# EAGLE design radio_V12.09.03 (EAGLE 5.01)
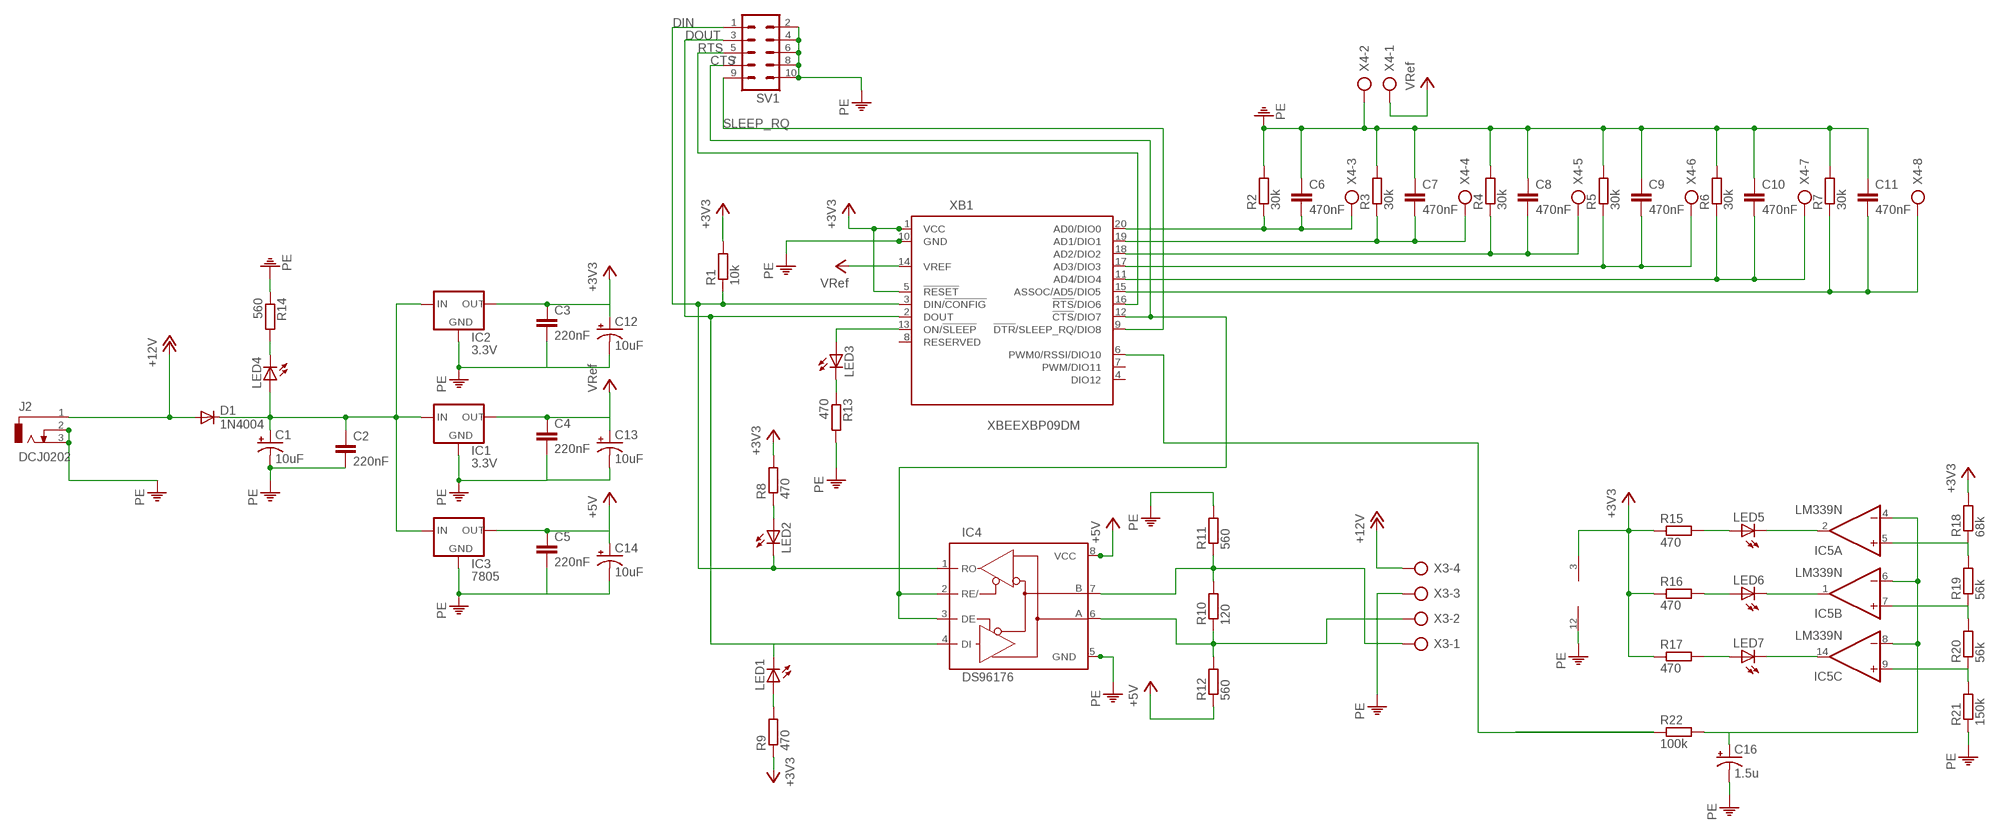
[diagram p0: schematic, sheet 1]

## Parts
C1  10uF  CPOL-USE2-5  [E2-5]
C2  220nF  C5/3.5  [C5B3.5]
C3  220nF  C5/3.5  [C5B3.5]
C4  220nF  C5/3.5  [C5B3.5]
C5  220nF  C5/3.5  [C5B3.5]
C6  470nF  C5/3.5  [C5B3.5]
C7  470nF  C5/3.5  [C5B3.5]
C8  470nF  C5/3.5  [C5B3.5]
C9  470nF  C5/3.5  [C5B3.5]
C10  470nF  C5/3.5  [C5B3.5]
C11  470nF  C5/3.5  [C5B3.5]
C12  10uF  CPOL-USE2-5  [E2-5]
C13  10uF  CPOL-USE2-5  [E2-5]
C14  10uF  CPOL-USE2-5  [E2-5]
C16  1.5u  CPOL-USE2-5  [E2-5]
D1  1N4004  [DO41-10]
IC1  3.3V  78XXL  [78XXL]
IC2  3.3V  78XXL  [78XXL]
IC3  7805  78XXL  [78XXL]
IC4  DS96176  MAX3468CPA  [DIL08]
IC5  LM339N  [DIL14]
J2  DCJ0202  [DCJ0202]
LED1  LED3MM  [LED3MM]
LED2  LED3MM  [LED3MM]
LED3  LED3MM  [LED3MM]
LED4  LED5MM  [LED5MM]
LED5  LED3MM  [LED3MM]
LED6  LED3MM  [LED3MM]
LED7  LED3MM  [LED3MM]
R1  10k  R-EU_0207/7  [0207/7]
R2  30k  R-EU_0207/7  [0207/7]
R3  30k  R-EU_0207/7  [0207/7]
R4  30k  R-EU_0207/7  [0207/7]
R5  30k  R-EU_0207/7  [0207/7]
R6  30k  R-EU_0207/7  [0207/7]
R7  30k  R-EU_0207/7  [0207/7]
R8  470  R-EU_0207/7  [0207/7]
R9  470  R-EU_0207/7  [0207/7]
R10  120  R-EU_0207/7  [0207/7]
R11  560  R-EU_0207/7  [0207/7]
R12  560  R-EU_0207/7  [0207/7]
R13  470  R-EU_0207/7  [0207/7]
R14  560  R-EU_0207/7  [0207/7]
R15  470  R-EU_0207/7  [0207/7]
R16  470  R-EU_0207/7  [0207/7]
R17  470  R-EU_0207/7  [0207/7]
R18  68k  R-EU_0207/7  [0207/7]
R19  56k  R-EU_0207/7  [0207/7]
R20  56k  R-EU_0207/7  [0207/7]
R21  150k  R-EU_0207/7  [0207/7]
R22  100k  R-EU_0207/7  [0207/7]
SV1  ML10  [ML10]
X3  AK500/4-H  [AK500/4-H]
X4  AK500/8-H  [AK500/8-H]
XB1  XBEEXBP09DM  [XBEE-PRO]

## Nets
+3V3: C3.1 C12.+ IC2.OUT IC5.3(P:V+) R1.2 R8.2 R9.1 R15.1 R16.1 R17.1 R18.2 XB1.1(VCC) XB1.5(!RESET)
+5V: C5.1 C14.+ IC3.OUT IC4.8(VCC) R12.1
+12V: D1.A J2.1 X3.4
CTS: IC4.2(RE/) IC4.3(DE) SV1.7 XB1.12(!CTS!/DIO7)
DIN: IC4.1(RO) LED2.K(C) R1.1 SV1.1 XB1.3(DIN/!CONFIG)
DOUT: IC4.4(DI) LED1.K(C) SV1.3 XB1.2(DOUT)
N$2: C1.+ C2.1 D1.C IC1.IN IC2.IN IC3.IN LED4.A
N$3: C6.2 R2.1 X4.3 XB1.20(AD0/DIO0)
N$4: C7.2 R3.1 X4.4 XB1.19(AD1/DIO1)
N$5: C8.2 R4.1 X4.5 XB1.18(AD2/DIO2)
N$6: C9.2 R5.1 X4.6 XB1.17(AD3/DIO3)
N$7: C10.2 R6.1 X4.7 XB1.11(AD4/DIO4)
N$8: C11.2 R7.1 X4.8 XB1.15(ASSOC/AD5/DIO5)
N$10: LED2.A R8.1
N$11: LED1.A R9.2
N$13: LED3.A XB1.13(ON/!SLEEP)
N$14: LED3.K(C) R13.1
N$15: LED4.K(C) R14.2
N$16: IC4.6(A) R10.1 R12.2 X3.2
N$17: IC4.7(B) R10.2 R11.1 X3.1
N$24: IC5.2(A:OUT) LED5.K(C)
N$25: IC5.1(B:OUT) LED6.K(C)
N$26: IC5.14(C:OUT) LED7.K(C)
N$27: LED7.A R17.2
N$28: LED6.A R16.2
N$29: LED5.A R15.2
N$30: IC5.5(A:+IN) R18.1 R19.2
N$31: IC5.7(B:+IN) R19.1 R20.2
N$32: IC5.9(C:+IN) R20.1 R21.2
N$33: C16.+ IC5.4(A:-IN) IC5.6(B:-IN) IC5.8(C:-IN) R22.2
N$36: R22.1 XB1.6(PWM0/RSSI/DIO10)
PE: C1.- C2.2 C3.2 C4.2 C5.2 C6.1 C7.1 C8.1 C9.1 C10.1 C11.1 C12.- C13.- C14.- C16.- IC1.GND IC2.GND IC3.GND IC4.5(GND) IC5.12(P:GND) J2.2 J2.3 R2.2 R3.2 R4.2 R5.2 R6.2 R7.2 R11.2 R13.2 R14.1 R21.1 SV1.2 SV1.4 SV1.6 SV1.8 SV1.10 X3.3 X4.2 XB1.10(GND)
RTS: SV1.5 XB1.16(!RTS!/DIO6)
SLEEP_RQ: SV1.9 XB1.9(!DTR!/SLEEP_RQ/DIO8)
VCC: C4.1 C13.+ IC1.OUT X4.1 XB1.14(VREF) ; supply symbol labelled VRef
Unconnected: IC5.10(D:-IN) IC5.11(D:+IN) IC5.13(D:OUT) XB1.7(PWM/DIO11)

## Power pins joined to a net without a drawn wire
DIO12: XB1.4(DIO12)
RESERVED: XB1.8(RESERVED)

## Library data of the parts
C1 C12-C14 C16 = rcl:CPOL-US: POLARIZED CAPACITOR, American symbol
C2-C11 = capacitor-wima:C: CAPACITOR naming: grid - package width
D1 = diode:1N4004: DIODE general purpose rectifier, 1 A
IC1-IC3 = v-reg:78XXL: VOLTAGE REGULATOR
IC4 = maxim:MAX34*: +5V, Fail-Safe, 40Mbps, Profibus RS-485/RS-422 Transceivers Source: MAX3465-MAX3469.pdf
IC5 = linear:LM339: Low Power Low Offset Voltage Quad Comparators with open collector; LM139/LM239/LM339/LM2901/LM3302
J2 = con-jack:DCJ0202: DC POWER JACK Source: DCJ0202.pdf
LED1-LED7 = led:LED: LED OSRAM: - CHIPLED LG R971, LG N971, LY N971, LG Q971, LY Q971, LO R971, LY R971 LH N974, LH R974 LS Q976, LO Q976, LY Q976 LO Q996 - Hyper CHIPLED LW Q18S LB Q993, LB Q99A, LB R99A - SideLED LS A670, LO A670, LY A670, LG A670, LP A670 LB A673, LV A673, LT A673, LW A673 LH A674 LY A675 LS A676, LA A676, LO A676, LY A676, LW A676 LS A679, LY A679, LG A679 - Hyper Micro SIDELED® LS Y876, LA Y876, LO Y876, LY Y876 LT Y87S - SmartLED LW L88C, LW L88S LB L89C, LB L89S, LG L890 LS L89K, LO L89K, LY L89K LS L896, LA L896, LO L896, LY L896 - TOPLED LS T670, LO T670, LY T670, LG T670, LP T670 LSG T670, LSP T670, LSY T670, LOP T670, LYG T670 LG T671, LOG T671, LSG T671 LB T673, LV T673, LT T673, LW T673 LH T674 LS T676, LA T676, LO T676, LY T676, LB T676, LH T676, LSB T676, LW T676 LB T67C, LV T67C, LT T67C, LS T67K, LO T67K, LY T67K, LW E67C LS E67B, LA E67B, LO E67B, LY E67B, LB E67C, LV E67C, LT E67C LW T67C LS T679, LY T679, LG T679 LS T770, LO T770, LY T770, LG T770, LP T770 LB T773, LV T773, LT T773, LW T773 LH T774 LS E675, LA E675, LY E675, LS T675 LS T776, LA T776, LO T776, LY T776, LB T776 LHGB T686 LT T68C, LB T68C - Hyper Mini TOPLED® LB M676 - Mini TOPLED Santana® LG M470 LS M47K, LO M47K, LY M47K Source: http://www.osram.convergy.de - LUMILED® LXK2-PW12-R00, LXK2-PW12-S00, LXK2-PW14-U00, LXK2-PW14-V00 LXK2-PM12-R00, LXK2-PM12-S00, LXK2-PM14-U00 LXK2-PE12-Q00, LXK2-PE12-R00, LXK2-PE12-S00, LXK2-PE14-T00, LXK2-PE14-U00 LXK2-PB12-K00, LXK2-PB12-L00, LXK2-PB12-M00, LXK2-PB14-N00, LXK2-PB14-P00, LXK2-PB14-Q00 LXK2-PR12-L00, LXK2-PR12-M00, LXK2-PR14-Q00, LXK2-PR14-R00 LXK2-PD12-Q00, LXK2-PD12-R00, LXK2-PD12-S00 LXK2-PH12-R00, LXK2-PH12-S00 LXK2-PL12-P00, LXK2-PL12-Q00, LXK2-PL12-R00 Source: www.luxeon.com
R1-R22 = resistor:R-EU_: RESISTOR, European symbol
SV1 = con-harting-ml:ML10: HARTING
X3 = con-ptr500:AK500/4-H: CONNECTOR Aug. 2004 / PTR Meßtechnik: Die Bezeichnung der Serie AK505 wurde geändert. Es handelt sich hierbei um AK500 in horizontaler Ausführung.
X4 = con-ptr500:AK500/8-H: CONNECTOR Aug. 2004 / PTR Meßtechnik: Die Bezeichnung der Serie AK505 wurde geändert. Es handelt sich hierbei um AK500 in horizontaler Ausführung.
XB1 = maxstream3:XBEE: XBee (TM) /XBee-PRO(TM) OEM RF Modules Source: MaxStream, Inc. xbee_productmanual.pdf

## Board
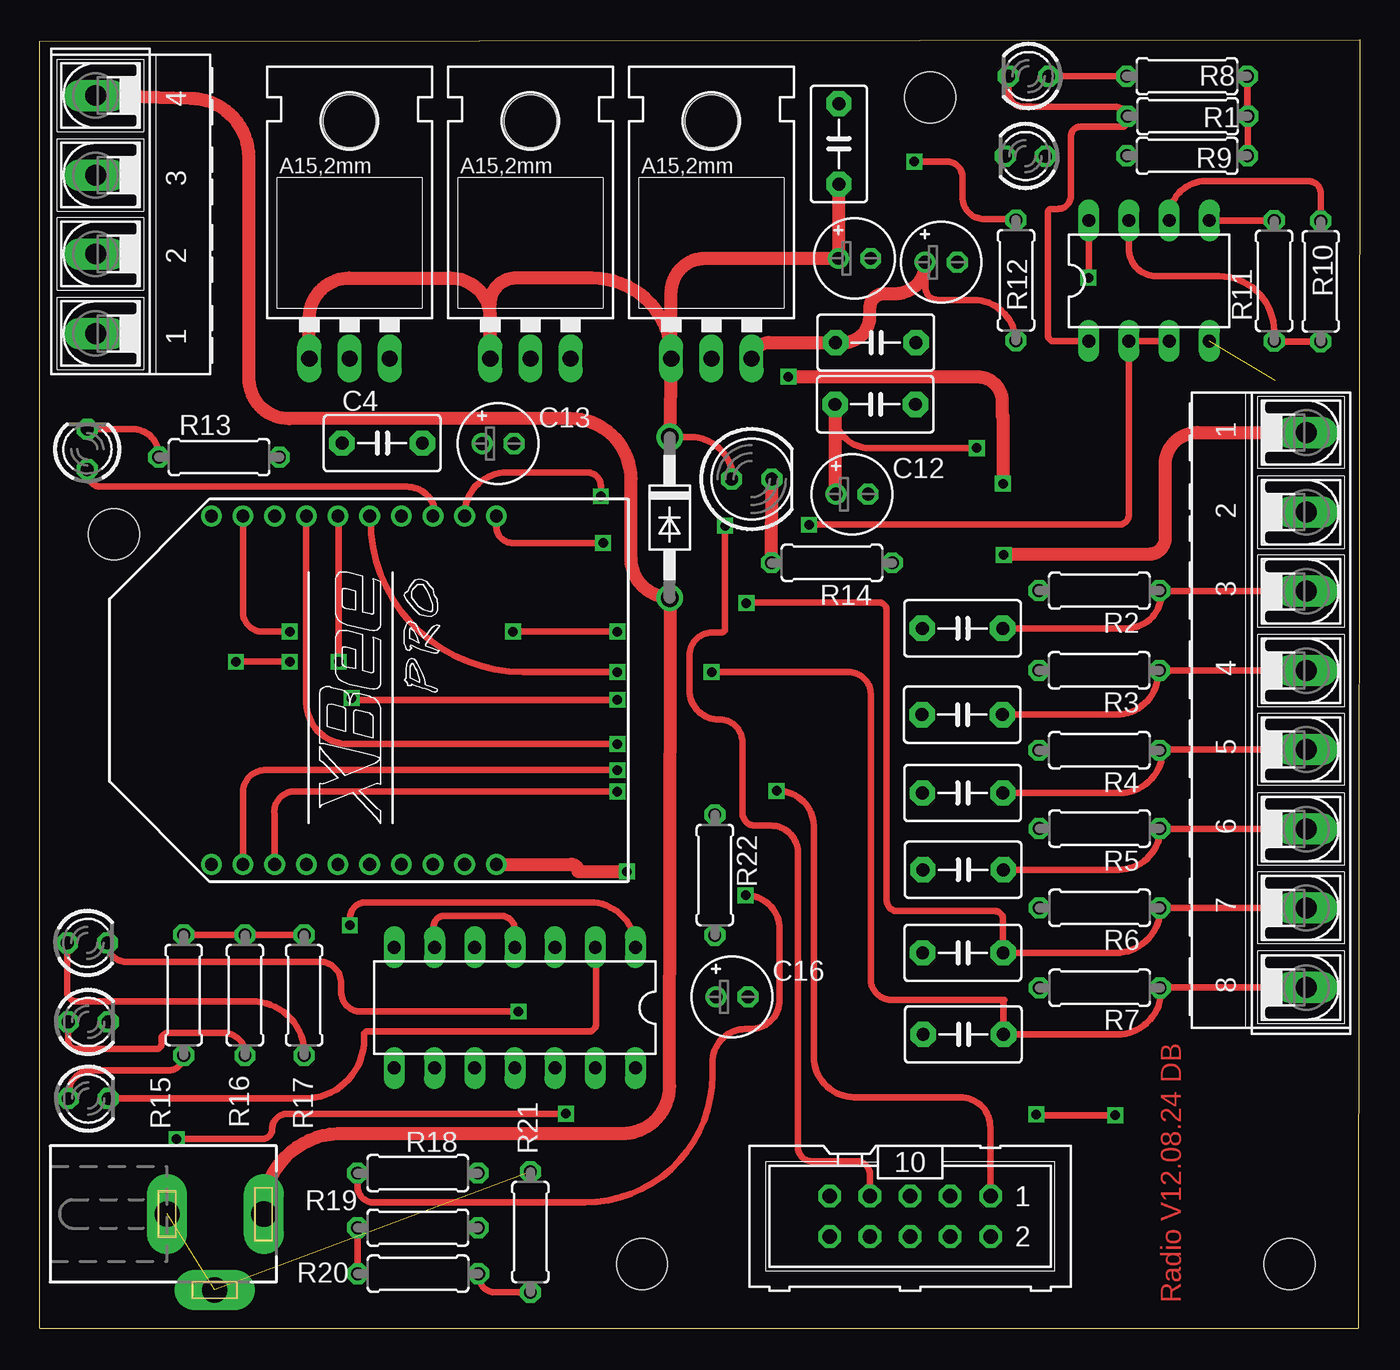
[diagram p1: board, top side]
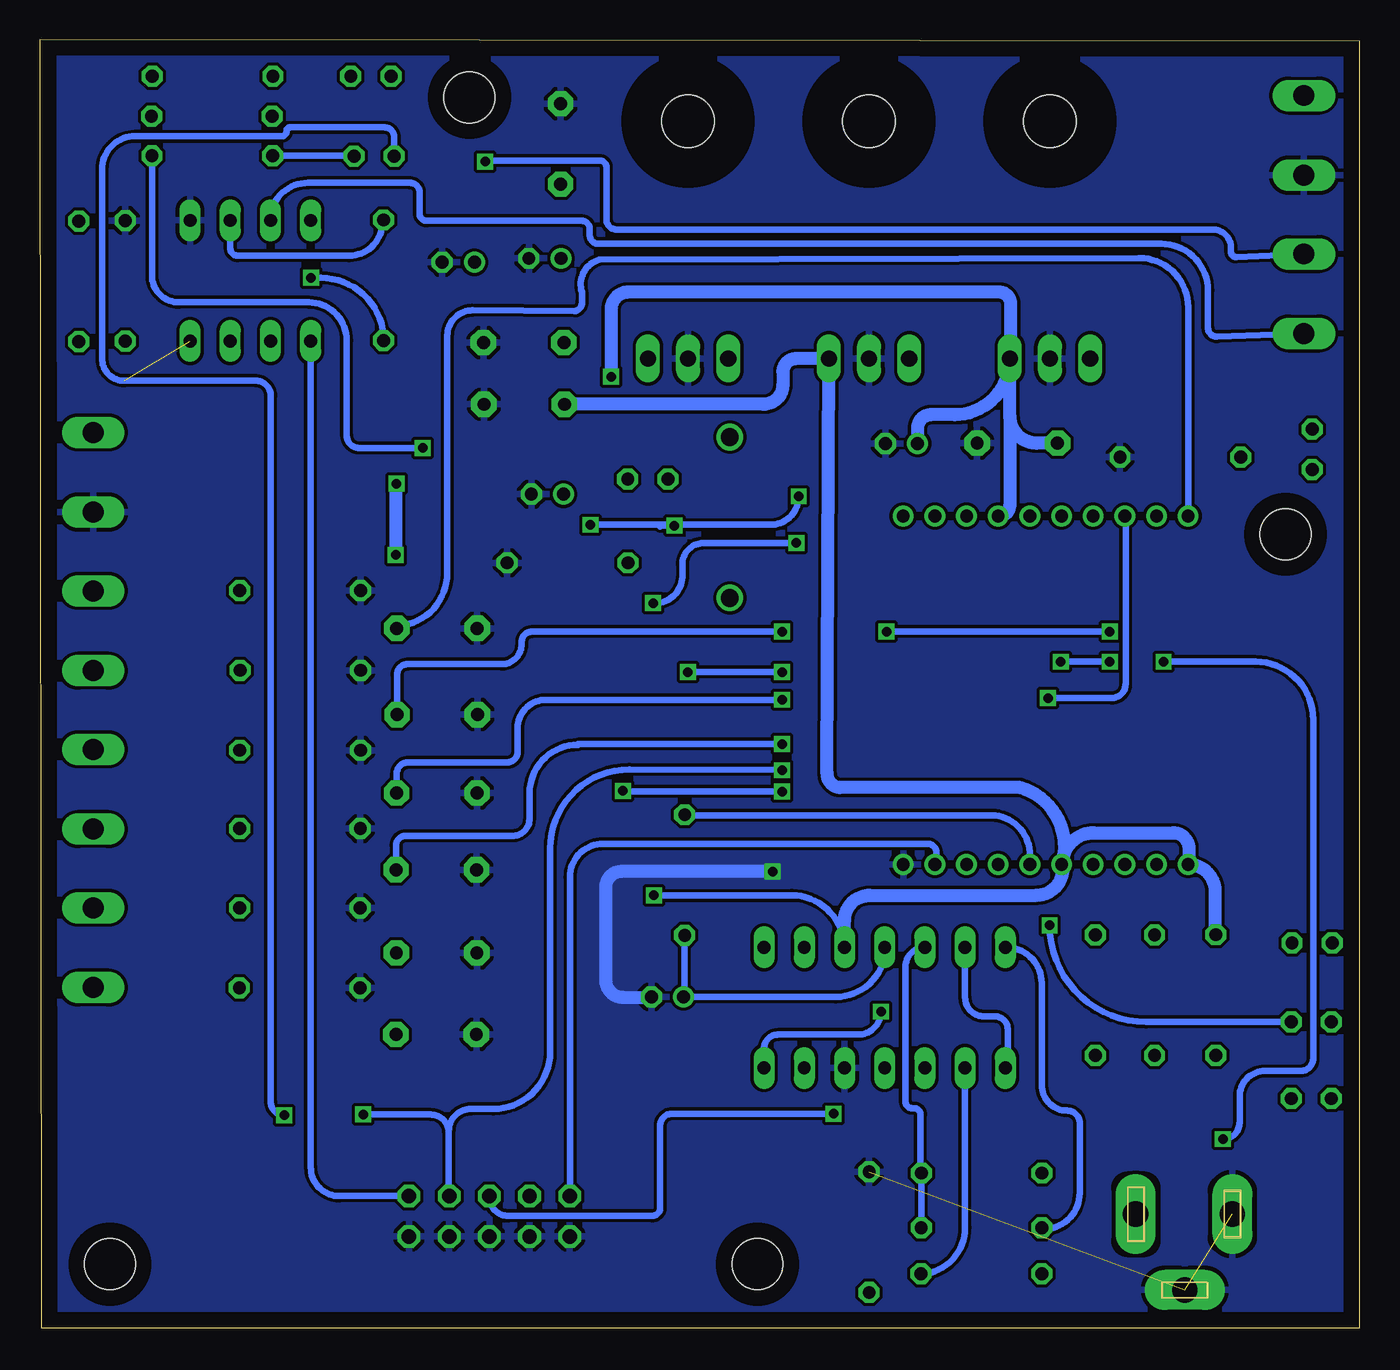
[diagram p2: board, bottom side, seen from below]

Size 83.4 x 81.4 mm. Coordinates in mm from the lower left corner, seen from the top.
Outline: 0,0 0,81.3 83.4,81.4 83.3,0 0,0
Outline: 7.5,8.7 8.6,8.7 8.6,5.7 7.5,5.7 7.5,8.7
Outline: 13.6,8.9 14.7,8.9 14.7,5.5 13.6,5.5 13.6,8.9
Outline: 9.6,1.9 12.5,1.9 12.5,2.9 9.6,2.9 9.6,1.9
Copper layers (1*16): Top 0.035mm / dielectric 1.5mm / Bottom 0.035mm
Design rules "default": minimum track width 10mil, minimum drill 24mil, track to track 8mil, track to pad 8mil, pad to pad 8mil, via to via 8mil, smd to smd 8mil, copper to edge 40mil, drill to drill 8mil, minimum pad ring 10mil, minimum via ring 8mil, stop-mask expansion 4mil, vias tented up to drill 0mil, thermal gap 10mil
Holes 3.2 mm at 78.95,4.05 38.05,4.05 56.25,77.75 4.7,50.15

### Footprints (pad centres in the part's own frame; a part is rotated, then mirrored left to right if it is on the bottom)
E2-5 = drill 0.813 pad 1.27 round: + -1.016,0 | drill 0.813 pad 1.27 octagon: - 1.016,0
C5B3.5 = drill 0.813 pad 1.6 octagon: 1 -2.54,0; 2 2.54,0
DO41-10 = drill 1.118 round: A 5.08,0; C -5.08,0
78XXL = drill 1.016 long: GND 0,-3.81; IN -2.54,-3.81; OUT 2.54,-3.81 | hole 3.302: 0,11.176
DIL08 = drill 0.813 long: 1 -3.81,-3.81; 2 -1.27,-3.81; 3 1.27,-3.81; 4 3.81,-3.81; 5 3.81,3.81; 6 1.27,3.81; 7 -1.27,3.81; 8 -3.81,3.81
DIL14 = drill 0.813 long: 1 -7.62,-3.81; 2 -5.08,-3.81; 3 -2.54,-3.81; 4 0,-3.81; 5 2.54,-3.81; 6 5.08,-3.81; 7 7.62,-3.81; 8 7.62,3.81; 9 5.08,3.81; 10 2.54,3.81; 11 0,3.81; 12 -2.54,3.81; 13 -5.08,3.81; 14 -7.62,3.81
DCJ0202 = drill 1.6 pad 2.54 long: 1 0,3.1; 2 4.8,0; 3 0,-3
LED3MM = drill 0.813 octagon: A -1.27,0; K 1.27,0
LED5MM = drill 0.813 octagon: A -1.27,0; K 1.27,0
0207/7 = drill 0.813 octagon: 1 -3.81,0; 2 3.81,0
ML10 = drill 0.914 octagon: 1 -5.08,-1.27; 2 -5.08,1.27; 3 -2.54,-1.27; 4 -2.54,1.27; 5 0,-1.27; 6 0,1.27; 7 2.54,-1.27; 8 2.54,1.27; 9 5.08,-1.27; 10 5.08,1.27
AK500/4-H = drill 1.321 long: 1 -7.518,0; 2 -2.489,0; 3 2.489,0; 4 7.518,0
AK500/8-H = drill 1.321 long: 1 -17.526,0; 2 -12.497,0; 3 -7.518,0; 4 -2.489,0; 5 2.489,0; 6 7.518,0; 7 12.497,0; 8 17.526,0
XBEE-PRO = drill 0.8 pad 1.27 round: 1 -11,9; 2 -11,7; 3 -11,5; 4 -11,3; 5 -11,1; 6 -11,-1; 7 -11,-3; 8 -11,-5; 9 -11,-7; 10 -11,-9; 11 11,-9; 12 11,-7; 13 11,-5; 14 11,-3; 15 11,-1; 16 11,1; 17 11,3; 18 11,5; 19 11,7; 20 11,9

### Placement (x,y rotation side)
C1  51.48,67.58 0 top
C2  50.49,74.81 90 top
C3  52.79,58.36 0 top
C4  21.64,55.91 0 top
C5  52.82,62.26 0 top
C6  58.3,44.21 0 top
C7  58.28,38.76 0 top
C8  58.31,33.81 0 top
C9  58.34,28.96 0 top
C10  58.32,23.71 0 top
C11  58.35,18.56 0 top
C12  51.32,52.68 0 top
C13  28.96,55.88 0 top
C14  56.95,67.33 0 top
C16  43.74,20.93 0 top
D1  39.8,51.21 270 top
IC1  19.58,65.07 0 top
IC2  31.01,65.07 0 top
IC3  42.44,65.07 0 top
IC4  70.08,66.17 0 top
IC5  30.02,20.25 180 top
J2  11.06,7.22 270 top
LED1  62.27,74.04 180 top
LED2  62.47,79.09 180 top
LED3  3.02,55.52 90 top
LED4  44.98,53.64 0 top
LED5  3.07,14.51 0 top
LED6  3.07,19.35 0 top
LED7  3.02,24.34 0 top
R1  72.52,76.56 0 top
R2  66.94,46.59 180 top
R3  66.93,41.56 180 top
R4  66.94,36.51 180 top
R5  66.95,31.56 180 top
R6  66.96,26.56 180 top
R7  66.97,21.51 180 top
R8  72.47,79.09 0 top
R9  72.49,74.06 180 top
R10  80.92,66.13 270 top
R11  77.98,66.16 90 top
R12  61.68,66.2 90 top
R13  11.34,55.02 0 top
R14  50.05,48.35 180 top
R15  9.1,21.05 270 top
R16  12.97,21.04 270 top
R17  16.71,21.04 270 top
R18  23.89,9.8 180 top
R19  23.9,6.35 0 top
R20  23.91,3.45 180 top
R21  31,6.07 270 top
R22  42.65,28.63 270 top
SV1  54.99,7.07 180 top
X3  3.54,70.35 90 top
X4  80.01,39.05 270 top
XB1  19.85,40.3 90 top

### Tracks (layer width: path | path; a pad name or v marks a point on that pad's centre or on a via)
+3V3  (via drill 0.6)
  Top 0.406: R16.1 13,24.85 | R15.1 arc90 R15.1 R16.1 | R16.1 R17.1 | R18.2 20.08,8.97 arc90 21.1,7.95 34.45,7.95 arc90 42.5,16 42.5,16.8 arc-90 44.6,18.9 44.9,18.9 arc90 46.75,20.75 46.75,25.2 arc90 v44.6,27.35 | R8.2 76.28,76.77 arc90 76.4,76.65 arc90 76.33,76.58 R1.2 76.33,74.17 arc90 76.45,74.05 arc90 76.44,74.06 R9.1 | 50.25,58.2 50.25,57.75 arc90 52.4,55.6 v59.2,55.6
  Top 0.813: C12.+ 50.3,52.8 arc90 50.25,52.85 50.25,58.2 C3.1
  Bottom 0.406: IC5.3 32.59,24.06 arc-90 32.6,24.05 arc-90 35.9,27.35 v44.6,27.35 | R9.1 76.3,66.5 arc-90 74.6,64.8 66.4,64.8 arc90 64,62.4 64,56.4 | 64,56.4 64,56.3 | C3.1 50.25,58.2 | v59.2,55.6 63.2,55.6 arc90 64,56.4
  Bottom 0.813: 18.8,29.3 arc-90 21.45,34.15 32.85,34.15 arc90 33.65,35.1 IC2.OUT 33.59,61.26 arc-90 33.6,61.25 35.6,61.25 arc-90 36.45,60.4 36.45,59.6 arc90 37.69,58.36 C3.1 | 18.8,29.3 XB1.5 18.85,29.15 arc-90 18.75,29.05 arc90 20.45,27.35 30.95,27.35 arc-90 32.56,25.74 IC5.3 | 18.8,29.3 arc90 16.8,31.3 11.8,31.3 arc90 10.8,30.3 10.8,29.35 arc90 XB1.1 arc90 9.15,27.6 9.15,24.91 arc-90 R15.1
+5V  (via drill 0.6)
  Top 0.406: 55.95,67.25 55.95,65.75 arc90 56.75,64.95 59,64.95 arc-90 61.65,62.3 arc90 61.68,62.33 R12.1 | IC4.8 66.27,66.37 arc-90 v66.25,66.35
  Top 0.813: IC3.OUT 45.04,61.26 arc-90 45.05,61.25 arc-90 46.06,62.26 C5.1 50.76,62.26 arc90 52.45,63.95 52.45,64.45 arc-90 53.35,65.35 54.05,65.35 arc90 55.95,67.25 arc-90 55.93,67.27 C14.+
  Bottom 0.406: R12.1 R12.1 arc-90 61.65,62.35 arc-90 65.65,66.35 v66.25,66.35
+12V
  Top 0.813: X3.4 9.52,77.67 arc-90 13.23,73.96 13.23,59.99 arc90 15.77,57.45 33.55,57.45 arc-90 37.36,53.64 37.36,48.64 arc90 39.85,46.15 arc-90 39.83,46.13 D1.A 39.8,46.15 arc90 39.75,46.2 arc-90 39.85,46.1 39.85,43.3 39.8,15.3 arc-90 36.8,12.3 18.8,12.3 arc90 14.16,7.16 J2.1
CTS  (via drill 0.6)
  Top 0.406: IC4.3 68.89,62.36 arc-90 68.85,62.4 arc90 IC4.2 68.81,51.41 arc-90 68.15,50.75 v48.6,50.75 | v35.45,52.55 35.45,53.2 arc90 34.6,54.05 29.5,54.05 arc90 26.85,51.4 XB1.12 | SV1.7 52.45,9.7 arc90 51.6,10.55 48.8,10.55 arc-90 47.9,11.45 47.9,30.05 arc90 46.2,31.75 45.2,31.75 arc-90 44.4,32.55 44.4,37 arc90 42.95,38.45 42.9,38.45 arc-90 41.05,40.3 41.05,42.5 arc-90 42.5,43.95 43.05,43.95 arc90 43.3,44.2 v43.3,50.7
  Bottom 0.406: 44.2,50.75 37.25,50.75 arc-90 v35.45,52.55 | 44.2,50.75 v48.6,50.75 | 44.2,50.75 44.2,50.65 arc90 44.15,50.7 v43.3,50.7
DIN  (via drill 0.6)
  Top 0.406: LED2.K 61.2,78.1 arc90 62.15,77.15 67.95,77.15 arc-90 68.65,76.45 arc90 68.71,76.51 R1.1 68.71,76.21 arc-90 68.4,75.9 65.75,75.9 arc90 65.15,75.3 65.15,71.55 arc-90 64.3,70.7 63.9,70.7 arc90 63.7,70.5 63.7,62.7 arc90 64.05,62.35 66.25,62.35 arc90 66.3,62.4 arc90 IC4.1 | XB1.3 14.85,32.4 arc-90 15.9,33.9 v36.5,33.9 | v46.55,33.95 arc-90 48.9,31.75 48.9,17.15 arc90 51.45,14.6 58.15,14.6 arc-90 60.05,12.7 60.05,8.55 arc90 60.15,8.45 arc90 60.07,8.37 SV1.1
  Bottom 0.406: IC4.1 66.27,10.17 arc-90 64.45,8.35 60.1,8.35 arc90 60.05,8.3 arc90 60.07,8.32 SV1.1 | v36.5,33.9 46.45,33.9 arc-90 v46.55,33.95
DOUT  (via drill 0.6)  (1 unrouted)
  Top 0.406: XB1.2 12.85,33.8 arc-90 14.2,35.25 36.2,35.25 arc90 v36.5,35.25 | v67.95,13.45 63,13.45 arc-90 v62.95,13.5
  Bottom 0.406: 57.45,8.4 arc90 57.6,8.25 arc-90 57.53,8.32 SV1.3 SV1.3 arc-90 57.4,8.2 arc90 57.55,8.35 57.55,12.35 | v36.5,35.25 46.15,35.3 arc-90 51.15,30.3 51.15,17.45 arc90 54.75,13.85 56.15,13.85 arc-90 57.55,12.45 57.55,12.35 | LED1.K 61,75.25 arc-90 61.6,75.85 67.6,75.85 arc-90 67.8,75.65 67.8,75.6 arc90 68.1,75.3 77.35,75.3 arc-90 79.45,73.2 79.45,61.25 arc-90 78.05,59.85 69.75,59.85 arc90 68.8,58.9 68.8,14.3 arc-90 v67.95,13.45 | v62.95,13.5 58.7,13.5 arc90 57.55,12.35
N$2
  Top 0.406: LED4.A 43.76,53.64 arc-90 43.8,53.6 arc90 41.11,56.29 D1.C
  Top 0.813: IC1.IN 17.04,63.8 arc-90 19.58,66.34 25.93,66.34 arc-90 28.47,63.8 IC2.IN 28.47,64.72 arc-90 30.1,66.35 34.9,66.35 arc-90 39.9,61.35 | D1.C IC3.IN 39.9,61.35 | C2.1 50.49,67.51 arc90 50.5,67.5 arc-90 50.46,67.54 C1.+ 42.03,67.58 arc90 39.9,65.45 39.9,61.35
N$3
  Top 0.406: X4.3 70.67,46.57 arc90 70.55,46.45 arc-90 70.69,46.59 R2.1 70.75,46.5 arc90 70.85,46.4 arc-90 68.66,44.21 C6.2
  Bottom 0.406: XB1.20 10.85,64.5 arc-90 13.95,67.6 48.05,67.5 arc-90 49.15,65.45 49.15,64.85 arc90 49.6,64.25 56.05,64.3 arc-90 57.65,62.7 57.65,47.7 arc90 61,44.35 arc-90 60.86,44.21 C6.2
N$4  (via drill 0.6)
  Top 0.406: X4.4 70.86,41.54 arc-90 70.85,41.55 arc90 70.84,41.56 R3.1 70.74,41.49 arc-90 70.65,41.4 arc-90 68.01,38.76 C7.2 | v29.9,44 v36.5,44 | v15.8,44 14.1,44 arc-90 12.85,45.25 XB1.19
  Bottom 0.406: C7.2 60.82,41.28 arc90 60.15,41.95 54.2,41.95 arc-90 52.95,43.2 52.95,43.35 arc90 52.3,44 v36.5,44 | v15.8,44 v29.9,44
N$5  (via drill 0.6)
  Top 0.406: X4.5 70.91,36.56 arc90 70.9,36.55 arc-90 70.86,36.51 R4.1 70.91,36.51 arc90 70.95,36.55 arc-90 68.21,33.81 C8.2 | v36.5,39.7 19.8,39.7 arc-90 v19.7,39.8
  Bottom 0.406: C8.2 60.85,35 arc90 60.1,35.75 53.85,35.75 arc-90 53.2,36.4 53.2,37.9 arc90 51.4,39.7 v36.5,39.7 | v19.7,39.8 15.7,39.8 arc-90 14.8,40.7 14.8,50.85 arc-90 15.05,51.1 arc-90 XB1.18
N$6  (via drill 0.6)
  Top 0.406: X4.6 70.82,31.53 arc-90 70.65,31.7 arc-90 70.76,31.59 R5.1 arc-90 70.8,31.6 arc-90 68.16,28.96 C9.2 | v36.5,36.9 19.55,36.9 arc-90 16.85,39.5 16.85,51.1 arc90 16.75,51.2 arc90 XB1.17
  Bottom 0.406: v36.5,36.9 49.4,36.9 49.4,36.85 arc-90 52.45,33.8 52.45,32.2 arc90 53.55,31.1 60.3,31.1 arc-90 60.88,30.52 C9.2
N$7  (via drill 0.6)
  Top 0.406: X4.7 70.85,26.55 arc90 70.7,26.4 arc90 70.77,26.47 R6.1 70.79,26.56 arc-90 70.8,26.55 arc-90 67.96,23.71 C10.2 60.86,25.84 arc90 60.35,26.35 54.2,26.35 arc-90 53.5,27.05 53.5,45.35 arc90 53,45.85 44.9,45.85 arc90 v44.65,45.8 | XB1.11 28.85,50.65 arc90 29.9,49.6 v35.6,49.6
  Bottom 0.406: v35.6,49.6 41.45,49.6 arc-90 42.8,48.25 42.8,47.45 arc90 v44.65,45.8
N$8  (via drill 0.6)
  Top 0.406: X4.8 70.73,21.52 arc-90 70.7,21.55 arc90 70.74,21.51 R7.1 70.78,21.42 arc90 70.85,21.35 arc-90 68.06,18.56 C11.2 60.89,20.69 arc-90 60.95,20.75 53.8,20.75 arc-90 52.5,22.05 52.5,40.05 arc90 51.1,41.45 v42.45,41.45 | XB1.15 20.85,51.15 arc90 20.9,51.1 arc90 30.55,41.45 v36.5,41.45
  Bottom 0.406: v36.5,41.45 v42.45,41.45
N$10
  Top 0.406: LED2.A 63.79,79.09 arc90 63.85,79.15 arc90 63.91,79.09 R8.1
N$11
  Bottom 0.406: LED1.A arc-90 63.45,73.95 arc-90 63.56,74.06 R9.2
N$13
  Top 0.406: LED3.A 3.02,54.03 arc90 3.9,53.15 23.2,53.15 arc-90 25,51.35 arc-90 24.95,51.3 XB1.13
N$14
  Top 0.406: R13.1 7.53,55.17 arc90 7.5,55.2 arc90 5.91,56.79 LED3.K
N$15
  Top 0.813: R14.2 LED4.K
N$16  (via drill 0.6)
  Top 0.406: R10.1 80.92,71.73 arc90 80.2,72.45 73.65,72.45 arc90 71.35,70.15 IC4.6 | v55.25,73.7 57.3,73.7 arc-90 58.3,72.7 58.3,71.45 arc90 59.7,70.05 61.7,70.05 arc90 61.68,70.03 R12.2
  Bottom 0.406: X3.2 7.81,67.66 arc90 8.15,68 8.15,68.25 arc-90 9.3,69.4 46.95,69.4 arc90 47.6,70.05 47.6,73.35 arc-90 48,73.75 55.2,73.75 arc-90 v55.25,73.7 | IC4.6 71.35,68.2 arc-90 70.9,67.75 63.85,67.75 arc-90 61.75,69.85 arc-90 61.68,69.92 R12.2
N$17
  Top 0.406: R10.2 77.97,62.32 arc90 77.95,62.3 arc90 77.98,62.33 R11.1 77.98,62.97 arc90 74.5,66.45 70.55,66.45 arc-90 68.8,68.2 68.8,69.85 arc-90 68.9,69.95 arc90 68.87,69.98 IC4.7
  Bottom 0.406: X3.1 9.03,62.63 arc90 9.6,63.2 9.6,65.55 arc-90 12.55,68.5 48.1,68.5 arc90 48.65,69.05 48.65,69.45 arc-90 49.15,69.95 58.95,69.95 arc90 59.4,70.4 59.4,71.75 arc-90 60,72.35 66.45,72.35 arc-90 68.85,69.95 arc90 IC4.7
N$24
  Top 0.406: LED5.K 16.76,14.51 arc90 20.5,18.25 20.5,18.55 arc-90 20.7,18.75 34.7,18.75 arc90 35.15,19.2 35.15,24.15 arc90 35.1,24.1 IC5.2
N$25  (via drill 0.6)
  Top 0.406: v19.6,25.45 19.6,25.9 arc-90 20.6,26.9 34.75,26.9 arc-90 37.65,24 arc-90 37.64,24.01 IC5.1
  Bottom 0.406: LED6.K 13.5,19.35 arc90 v19.6,25.45
N$26  (via drill 0.6)
  Top 0.406: v30.25,20 20.3,20 arc-90 19.05,21.25 19.05,21.8 arc90 17.7,23.15 5.45,23.15 arc-90 4.3,24.3 arc-90 4.29,24.31 LED7.K
  Bottom 0.406: IC5.14 37.64,17.66 arc90 36.75,18.55 31.7,18.55 arc-90 v30.25,20
N$27
  Top 0.406: LED7.A 1.75,21.2 arc90 2.3,20.65 13.4,20.65 arc-90 16.75,17.3 arc90 16.71,17.26 R17.2
N$28
  Top 0.406: LED6.A 1.8,18.15 arc90 2.3,17.65 7.4,17.65 arc90 7.7,17.95 7.7,18.25 arc-90 8.1,18.65 11.65,18.65 arc-90 13,17.3 arc90 12.97,17.27 R16.2
N$29
  Top 0.406: R15.2 arc-90 8.16,16.3 3.3,16.3 arc90 1.85,14.85 1.85,14.55 1.84,14.55 arc90 LED5.A
N$30
  Bottom 0.406: IC5.5 IC5.5 arc-90 27.5,24.05 arc-90 28.7,22.85 28.7,14.3 arc-90 28.3,13.9 28.15,13.9 arc90 27.75,13.5 27.75,9.8 R18.1 27.7,6.4 arc-90 27.71,6.39 R19.2
N$31
  Top 0.406: R20.2 20.1,3.35 arc-90 20.09,3.36 R19.1
  Bottom 0.406: IC5.7 22.36,24.06 arc90 20.1,21.8 20.1,15.35 arc-90 18.5,13.75 arc90 17.7,12.95 17.7,8.55 arc90 20,6.25 arc90 R19.1
N$32
  Top 0.406: R20.1 27.72,3.33 arc90 27.75,3.3 arc90 28.79,2.26 R21.2
  Bottom 0.406: R20.1 27.85,3.45 arc-90 27.9,3.4 arc-90 24.94,6.36 IC5.9
N$33
  Top 0.406: IC5.4 30.02,25.18 arc90 29.15,26.05 25.55,26.05 arc90 24.9,25.4 24.9,24.15 arc90 24.95,24.1 arc90 24.94,24.09 IC5.6
  Bottom 0.406: IC5.6 24.94,20.89 arc-90 23.75,19.7 23.05,19.7 arc90 22.25,18.9 22.25,16.65 arc90 22.45,16.45 arc-90 22.44,16.44 IC5.8 | R22.2 42.65,21.25 arc90 42.85,21.05 arc-90 C16.+ 33.12,20.93 arc-90 29.95,24.1 arc90 29.99,24.06 IC5.4
N$36
  Bottom 0.406: XB1.6 20.85,29.85 arc-90 23.25,32.4 42.7,32.4 arc90 R22.1
PE  (via drill 0.6)  (2 unrouted)
  Top 0.406: IC4.5 IC4.5 arc90 73.85,69.95 arc-90 73.87,69.97 R11.2
  Top 0.813: XB1.10 33.6,29.3 arc-90 34,28.9 arc90 34.05,28.85 v37.1,28.85
  Bottom 0.813: v37.1,28.85 46.65,28.85 arc-90 47.65,27.85 47.65,22 arc-90 46.55,20.9 44.79,20.9 arc-90 C16.-
  pour Bottom: 1,0.5 82.6,0.5 82.6,81.1 1,81.1
RTS  (via drill 0.6)
  Top 0.406: v8.65,11.95 14.05,11.95 arc90 14.7,12.6 arc-90 15.65,13.55 v33.25,13.55 | XB1.16 18.8,51.3 arc90 18.7,51.2 arc-90 18.9,51 18.9,44 | 18.9,44 18.9,43.9 | v12.4,42.1 v15.8,42.1 | v18.9,42.1 18.9,44
  Bottom 0.406: v8.65,11.95 arc-90 7.6,13 7.6,14.65 arc90 6,16.25 3.75,16.25 arc-90 2.95,17.05 2.95,38.45 arc-90 6.6,42.1 v12.4,42.1 | v33.25,13.55 43.45,13.55 arc-90 44.2,12.8 44.2,7.6 arc90 44.7,7.1 53.8,7.1 arc90 55,8.3 arc-90 54.99,8.31 SV1.5 | v15.8,42.1 v18.9,42.1
SLEEP_RQ
  Bottom 0.406: SV1.9 50.04,8.34 arc90 50.15,8.45 arc-90 49.9,8.7 49.9,28.5 arc90 47.8,30.6 27.3,30.6 arc90 26.75,30.05 26.75,29.4 arc90 26.8,29.35 arc-90 XB1.9
VCC  (via drill 0.6)
  Top 0.813: X4.1 73.13,56.58 arc90 71.1,54.55 71.1,49.9 arc-90 70.1,48.9 60.95,48.9 arc90 v60.9,48.85 | v60.85,53.35 60.85,57.6 arc90 60.8,57.65 60.8,58.55 arc90 59.25,60.1 v47.3,60.1
  Bottom 0.813: XB1.14 22.8,51.3 arc-90 22.12,51.98 22.12,57.6 | 22.12,57.6 IC1.OUT | 22.12,57.6 22.1,57.6 arc-90 20.41,55.91 C4.1 | C13.+ 27.94,56.86 arc90 27.1,57.7 25.6,57.7 arc-90 22.15,61.15 arc-90 22.12,61.18 IC1.OUT | v60.9,48.85 60.9,53.3 arc90 v60.85,53.35 | v47.3,60.1 47.3,64.35 arc90 46.2,65.45 22.8,65.45 arc90 22.05,64.7 22.05,61.25 arc90 22.1,61.2 arc90 22.12,61.22 IC1.OUT

### Text on the board
Top: Radio V12.08.24 DB